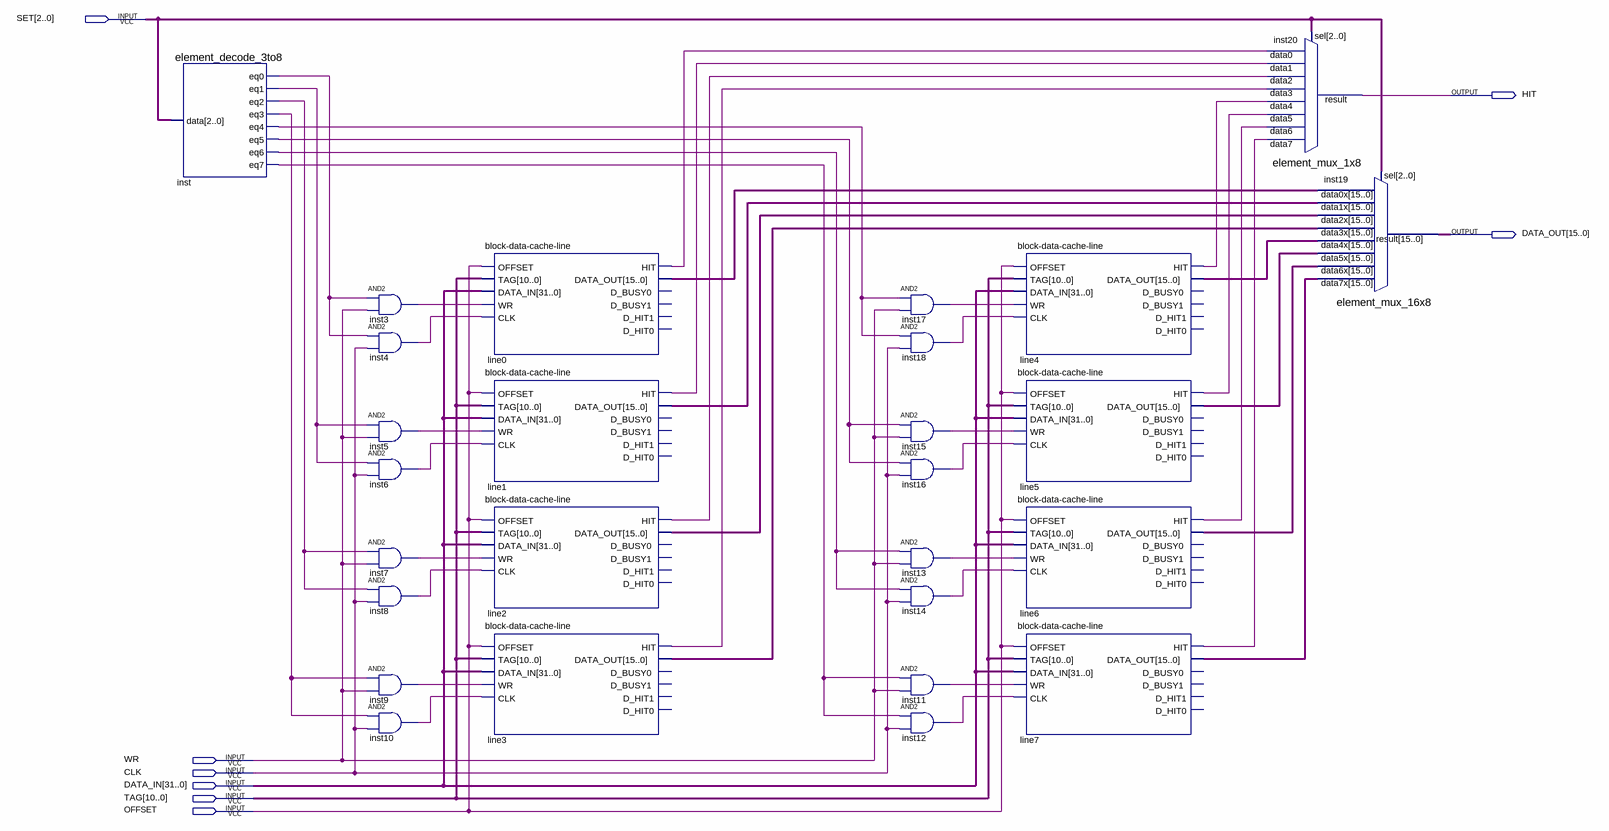
[diagram p0: schematic sheet]
// Quartus schematic block-data-cache-set.bdf as structural Verilog: 27 symbols, 8 pins
module \block-data-cache-set  (
  input  [2:0] SET,
  input  WR,
  input  CLK,
  input  [31:0] DATA_IN,
  input  [10:0] TAG,
  input  OFFSET,
  output HIT,
  output [15:0] DATA_OUT
);

  wire inst3_out, inst4_out, inst5_out, inst6_out, inst7_out, inst8_out, inst9_out, inst10_out, inst11_out,
       inst12_out, inst13_out, inst14_out, inst15_out, inst16_out, inst17_out, inst18_out, inst_eq0,
       inst_eq1, inst_eq2, inst_eq3, inst_eq4, inst_eq5, inst_eq6, inst_eq7, line0_hit, line1_hit, line2_hit,
       line3_hit, line4_hit, line5_hit, line6_hit, line7_hit;
  wire [15:0] line0_data_out, line1_data_out, line2_data_out, line3_data_out, line4_data_out, line5_data_out,
       line6_data_out, line7_data_out;

  element_decode_3to8 inst (
    .data(SET), .eq0(inst_eq0), .eq1(inst_eq1), .eq2(inst_eq2), .eq3(inst_eq3), .eq4(inst_eq4),
    .eq5(inst_eq5), .eq6(inst_eq6), .eq7(inst_eq7));
  and inst3 (inst3_out, inst_eq0, WR);
  and inst4 (inst4_out, inst_eq0, CLK);
  and inst5 (inst5_out, inst_eq1, WR);
  and inst6 (inst6_out, inst_eq1, CLK);
  and inst7 (inst7_out, inst_eq2, WR);
  and inst8 (inst8_out, inst_eq2, CLK);
  and inst9 (inst9_out, inst_eq3, WR);
  and inst10 (inst10_out, inst_eq3, CLK);
  \block-data-cache-line  line0 (
    .OFFSET(OFFSET), .TAG(TAG), .DATA_IN(DATA_IN), .WR(inst3_out), .CLK(inst4_out), .HIT(line0_hit),
    .DATA_OUT(line0_data_out));  // open: D_BUSY0, D_BUSY1, D_HIT1, D_HIT0
  \block-data-cache-line  line1 (
    .OFFSET(OFFSET), .TAG(TAG), .DATA_IN(DATA_IN), .WR(inst5_out), .CLK(inst6_out), .HIT(line1_hit),
    .DATA_OUT(line1_data_out));  // open: D_BUSY0, D_BUSY1, D_HIT1, D_HIT0
  \block-data-cache-line  line2 (
    .OFFSET(OFFSET), .TAG(TAG), .DATA_IN(DATA_IN), .WR(inst7_out), .CLK(inst8_out), .HIT(line2_hit),
    .DATA_OUT(line2_data_out));  // open: D_BUSY0, D_BUSY1, D_HIT1, D_HIT0
  \block-data-cache-line  line3 (
    .OFFSET(OFFSET), .TAG(TAG), .DATA_IN(DATA_IN), .WR(inst9_out), .CLK(inst10_out), .HIT(line3_hit),
    .DATA_OUT(line3_data_out));  // open: D_BUSY0, D_BUSY1, D_HIT1, D_HIT0
  and inst17 (inst17_out, inst_eq4, WR);
  and inst18 (inst18_out, inst_eq4, CLK);
  and inst15 (inst15_out, inst_eq5, WR);
  and inst16 (inst16_out, inst_eq5, CLK);
  and inst13 (inst13_out, inst_eq6, WR);
  and inst14 (inst14_out, inst_eq6, CLK);
  and inst11 (inst11_out, inst_eq7, WR);
  and inst12 (inst12_out, inst_eq7, CLK);
  \block-data-cache-line  line4 (
    .OFFSET(OFFSET), .TAG(TAG), .DATA_IN(DATA_IN), .WR(inst17_out), .CLK(inst18_out), .HIT(line4_hit),
    .DATA_OUT(line4_data_out));  // open: D_BUSY0, D_BUSY1, D_HIT1, D_HIT0
  \block-data-cache-line  line5 (
    .OFFSET(OFFSET), .TAG(TAG), .DATA_IN(DATA_IN), .WR(inst15_out), .CLK(inst16_out), .HIT(line5_hit),
    .DATA_OUT(line5_data_out));  // open: D_BUSY0, D_BUSY1, D_HIT1, D_HIT0
  \block-data-cache-line  line6 (
    .OFFSET(OFFSET), .TAG(TAG), .DATA_IN(DATA_IN), .WR(inst13_out), .CLK(inst14_out), .HIT(line6_hit),
    .DATA_OUT(line6_data_out));  // open: D_BUSY0, D_BUSY1, D_HIT1, D_HIT0
  \block-data-cache-line  line7 (
    .OFFSET(OFFSET), .TAG(TAG), .DATA_IN(DATA_IN), .WR(inst11_out), .CLK(inst12_out), .HIT(line7_hit),
    .DATA_OUT(line7_data_out));  // open: D_BUSY0, D_BUSY1, D_HIT1, D_HIT0
  element_mux_1x8 inst20 (
    .data7(line7_hit), .data6(line6_hit), .data5(line5_hit), .data4(line4_hit), .data3(line3_hit),
    .data2(line2_hit), .data1(line1_hit), .data0(line0_hit), .sel(SET), .result(HIT));
  element_mux_16x8 inst19 (
    .data7x(line7_data_out), .data6x(line6_data_out), .data5x(line5_data_out), .data4x(line4_data_out),
    .data3x(line3_data_out), .data2x(line2_data_out), .data1x(line1_data_out), .data0x(line0_data_out),
    .sel(SET), .result(DATA_OUT));
endmodule
